# EAGLE schematic arm_board (EAGLE 8.1.0)

## Sheet 1 of 4: I/O
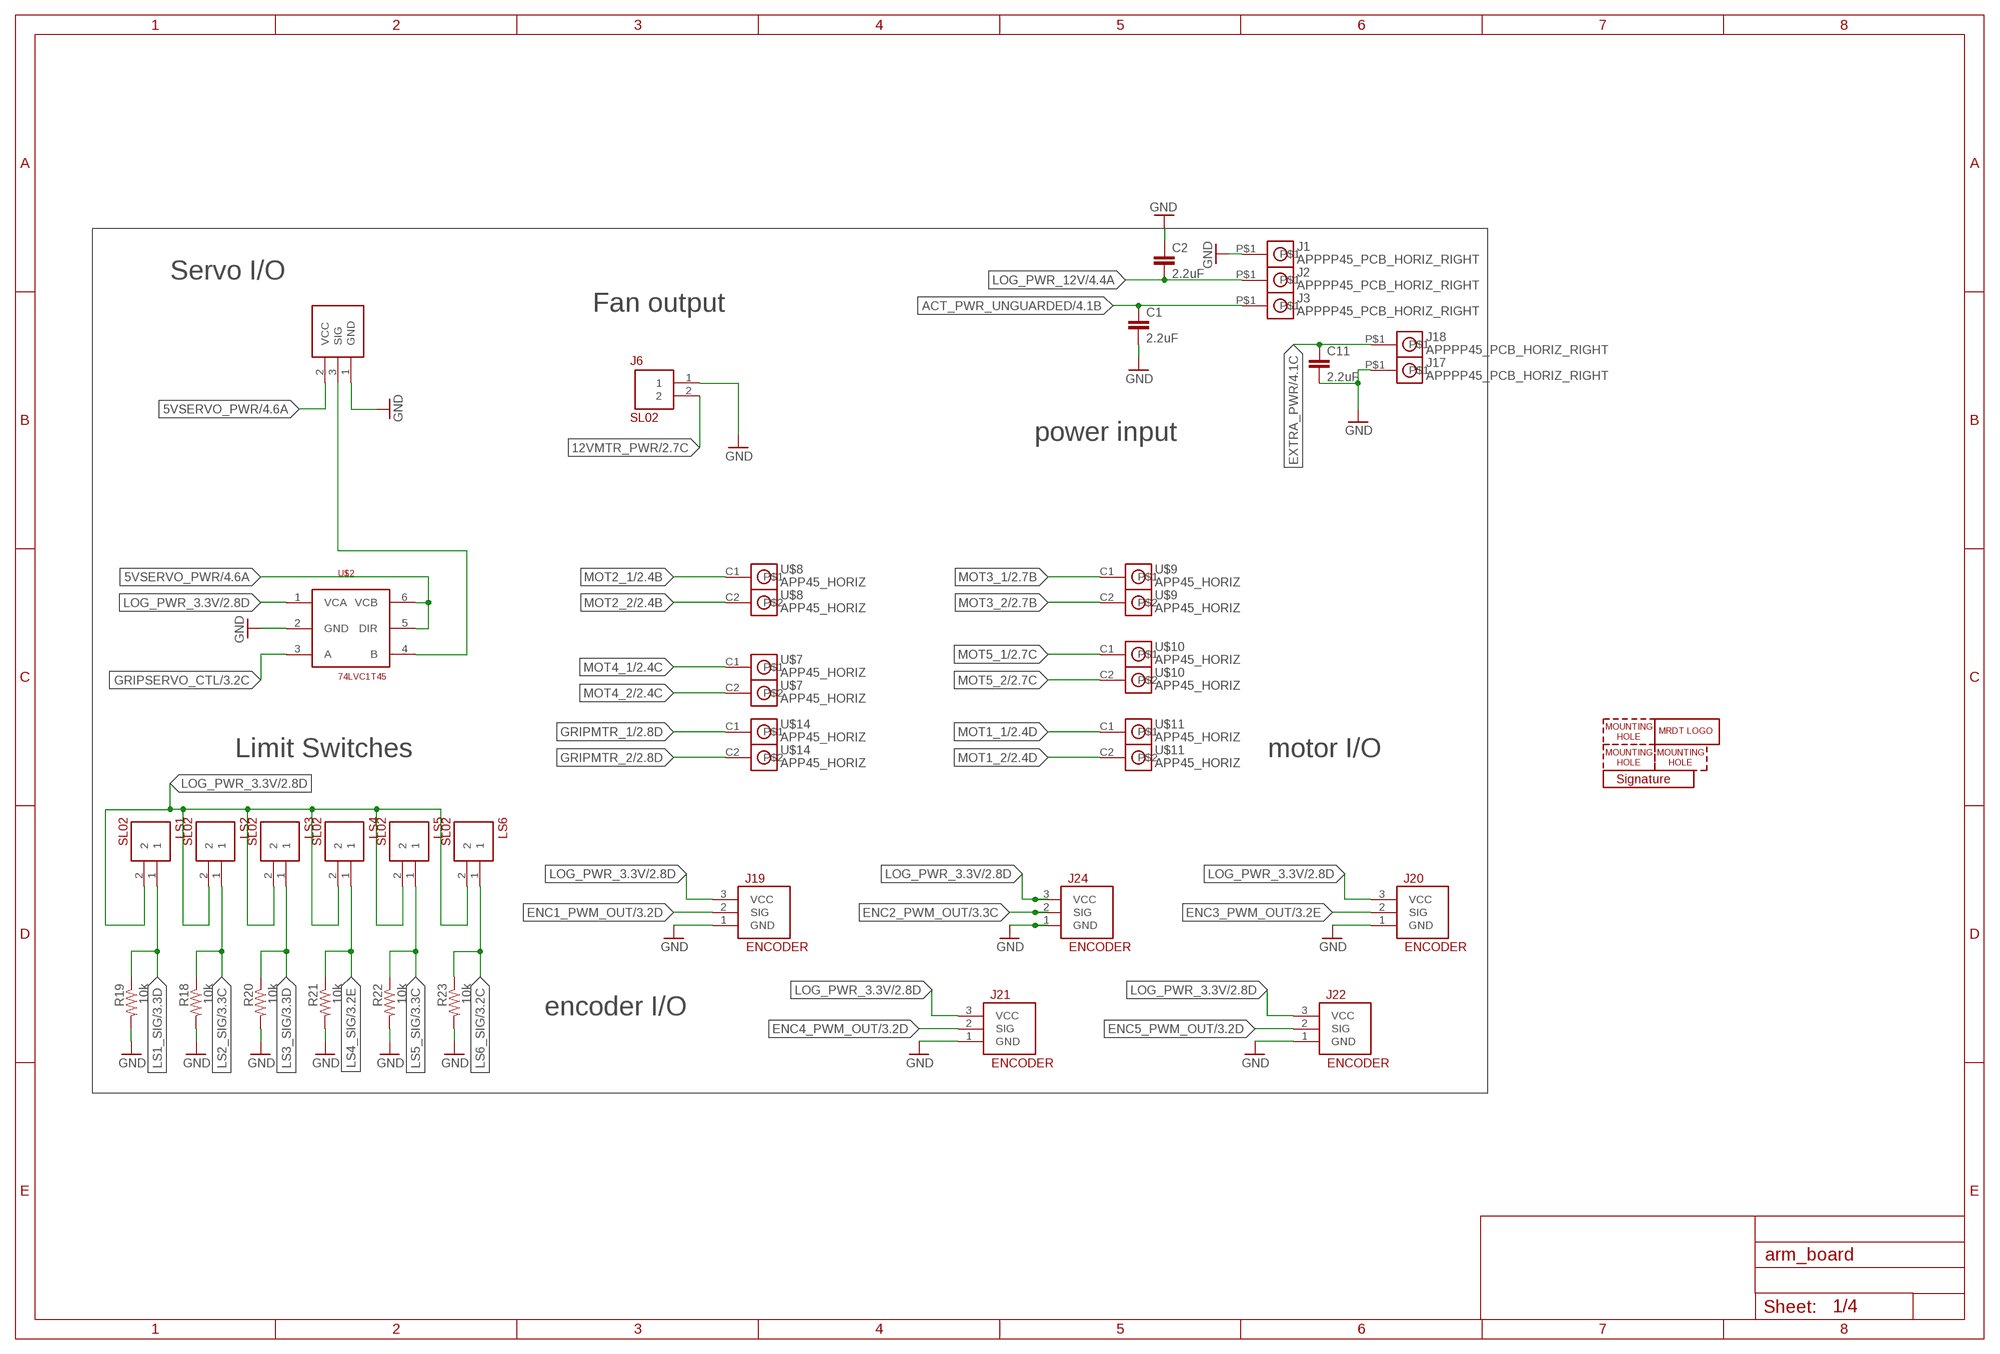
[diagram p0: schematic, sheet 1]

### Parts
C1  2.2uF  2.2UF-CERCAP-10009  [1206]
C2  2.2uF  2.2UF-CERCAP-10009  [1206]
C11  2.2uF  2.2UF-CERCAP-10009  [1206]
H1  MOUNTING_HOLE#4  [#4_SCREW]
H2  MOUNTING_HOLE#4  [#4_SCREW]
H4  MOUNTING_HOLE#4  [#4_SCREW]
J1  APPPP45_PCB_HORIZ_RIGHT  [APP45_PCB_HORIZ_RIGHT]
J2  APPPP45_PCB_HORIZ_RIGHT  [APP45_PCB_HORIZ_RIGHT]
J3  APPPP45_PCB_HORIZ_RIGHT  [APP45_PCB_HORIZ_RIGHT]
J5  SERVOMOLEX_SL_VERT_TH  [MOLEX-70543-0002]
J6  SL02  [MOLEX-70543-0001]
J17  APPPP45_PCB_HORIZ_RIGHT  [APP45_PCB_HORIZ_RIGHT]
J18  APPPP45_PCB_HORIZ_RIGHT  [APP45_PCB_HORIZ_RIGHT]
J19  ENCODER  [MOLEX-70543-0002]
J20  ENCODER  [MOLEX-70543-0002]
J21  ENCODER  [MOLEX-70543-0002]
J22  ENCODER  [MOLEX-70543-0002]
J24  ENCODER  [MOLEX-70543-0002]
LOGO1  MRDT_LOGO  [MRDT_LOGO]
LS1  SL02  [MOLEX-70543-0001]
LS2  SL02  [MOLEX-70543-0001]
LS3  SL02  [MOLEX-70543-0001]
LS4  SL02  [MOLEX-70543-0001]
LS5  SL02  [MOLEX-70543-0001]
LS6  SL02  [MOLEX-70543-0001]
R18  10k  RESISTOR0603-RES  [0603-RES]
R19  10k  RESISTOR0603-RES  [0603-RES]
R20  10k  RESISTOR0603-RES  [0603-RES]
R21  10k  RESISTOR0603-RES  [0603-RES]
R22  10k  RESISTOR0603-RES  [0603-RES]
R23  10k  RESISTOR0603-RES  [0603-RES]
U$2  74LVC1T45  [TSOP-6]
U$7  APP45_HORIZ  [APP45_HORIZ_CONFIG]
U$8  APP45_HORIZ  [APP45_HORIZ_CONFIG]
U$9  APP45_HORIZ  [APP45_HORIZ_CONFIG]
U$10  APP45_HORIZ  [APP45_HORIZ_CONFIG]
U$11  APP45_HORIZ  [APP45_HORIZ_CONFIG]
U$14  APP45_HORIZ  [APP45_HORIZ_CONFIG]
U$17  SIG  [SIG]

### Nets
5VSERVO_PWR: J5.2(VCC) U$2.5(DIR) U$2.6(VCB) ; also sheet 4
12VMTR_PWR: J6.2 ; also sheet 2,4
ACT_PWR_UNGUARDED: C1.1 J3.P$1 ; also sheet 4
ENC1_PWM_OUT: J19.2(SIG) ; also sheet 3
ENC2_PWM_OUT: J24.2(SIG) ; also sheet 3
ENC3_PWM_OUT: J20.2(SIG) ; also sheet 3
ENC4_PWM_OUT: J21.2(SIG) ; also sheet 3
ENC5_PWM_OUT: J22.2(SIG) ; also sheet 3
EXTRA_PWR: C11.1 J18.P$1 ; also sheet 4
GND: C1.2 C2.1 C11.2 J1.P$1 J5.1(GND) J6.1 J17.P$1 J19.1(GND) J20.1(GND) J21.1(GND) J22.1(GND) J24.1(GND) R18.2 R19.2 R20.2 R21.2 R22.2 R23.2 U$2.2(GND) ; also sheet 2,3,4
GRIPMTR_1: U$14.C1 ; also sheet 2
GRIPMTR_2: U$14.C2 ; also sheet 2
GRIPSERVO_CTL: U$2.3(A) ; also sheet 3
LOG_PWR_3.3V: J19.3(VCC) J20.3(VCC) J21.3(VCC) J22.3(VCC) J24.3(VCC) LS1.2 LS2.2 LS3.2 LS4.2 LS5.2 LS6.2 U$2.1(VCA) ; also sheet 2,3,4
LOG_PWR_12V: C2.2 J2.P$1 ; also sheet 4
LS1_SIG: LS1.1 R19.1 ; also sheet 3
LS2_SIG: LS2.1 R18.1 ; also sheet 3
LS3_SIG: LS3.1 R20.1 ; also sheet 3
LS4_SIG: LS4.1 R21.1 ; also sheet 3
LS5_SIG: LS5.1 R22.1 ; also sheet 3
LS6_SIG: LS6.1 R23.1 ; also sheet 3
MOT1_1: U$11.C1 ; also sheet 2
MOT1_2: U$11.C2 ; also sheet 2
MOT2_1: U$8.C1 ; also sheet 2
MOT2_2: U$8.C2 ; also sheet 2
MOT3_1: U$9.C1 ; also sheet 2
MOT3_2: U$9.C2 ; also sheet 2
MOT4_1: U$7.C1 ; also sheet 2
MOT4_2: U$7.C2 ; also sheet 2
MOT5_1: U$10.C1 ; also sheet 2
MOT5_2: U$10.C2 ; also sheet 2
N$2: J5.3(SIG) U$2.4(B)

### Notes on the sheet
- Servo I/O
- Fan output
- power input
- Limit Switches | motor I/O
- encoder I/O

## Sheet 2 of 4: Hbridge
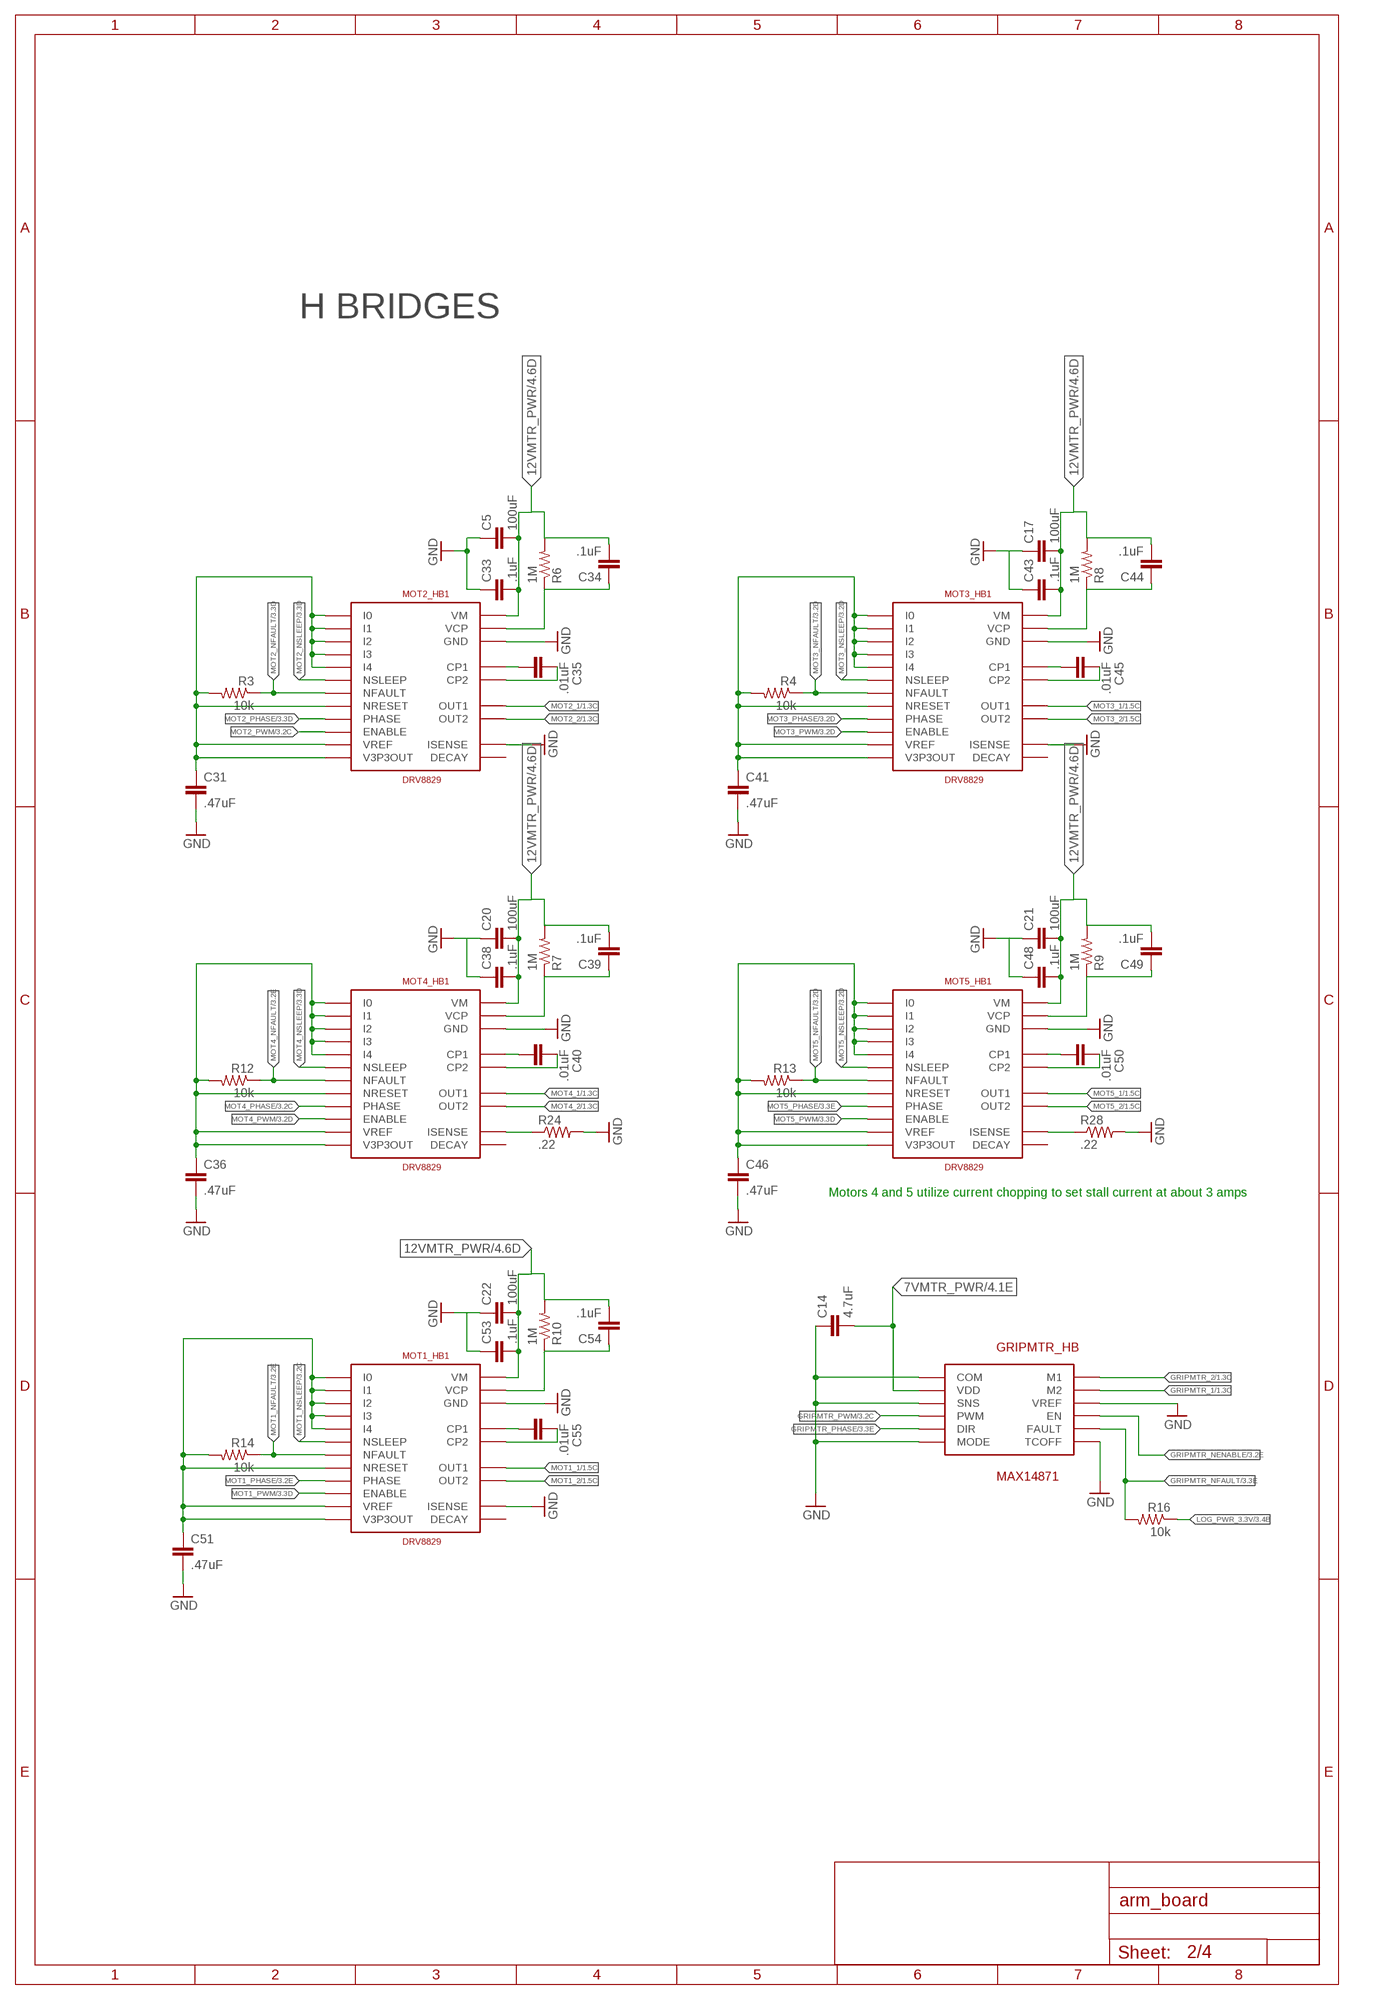
[diagram p1: schematic, sheet 2]

### Parts
C5  100uF  CAP1210  [1210]
C14  4.7uF  1.0UF50V10%(1206)  [1206]
C17  100uF  CAP1210  [1210]
C20  100uF  CAP1210  [1210]
C21  100uF  CAP1210  [1210]
C22  100uF  CAP1210  [1210]
C31  .47uF  0.1UF-25V(+80/-20%)(0603)  [0603-CAP]
C33  .1uF  0.1UF-25V(+80/-20%)(0603)  [0603-CAP]
C34  .1uF  0.1UF-25V(+80/-20%)(0603)  [0603-CAP]
C35  .01uF  0.1UF-25V(+80/-20%)(0603)  [0603-CAP]
C36  .47uF  0.1UF-25V(+80/-20%)(0603)  [0603-CAP]
C38  .1uF  0.1UF-25V(+80/-20%)(0603)  [0603-CAP]
C39  .1uF  0.1UF-25V(+80/-20%)(0603)  [0603-CAP]
C40  .01uF  0.1UF-25V(+80/-20%)(0603)  [0603-CAP]
C41  .47uF  0.1UF-25V(+80/-20%)(0603)  [0603-CAP]
C43  .1uF  0.1UF-25V(+80/-20%)(0603)  [0603-CAP]
C44  .1uF  0.1UF-25V(+80/-20%)(0603)  [0603-CAP]
C45  .01uF  0.1UF-25V(+80/-20%)(0603)  [0603-CAP]
C46  .47uF  0.1UF-25V(+80/-20%)(0603)  [0603-CAP]
C48  .1uF  0.1UF-25V(+80/-20%)(0603)  [0603-CAP]
C49  .1uF  0.1UF-25V(+80/-20%)(0603)  [0603-CAP]
C50  .01uF  0.1UF-25V(+80/-20%)(0603)  [0603-CAP]
C51  .47uF  0.1UF-25V(+80/-20%)(0603)  [0603-CAP]
C53  .1uF  0.1UF-25V(+80/-20%)(0603)  [0603-CAP]
C54  .1uF  0.1UF-25V(+80/-20%)(0603)  [0603-CAP]
C55  .01uF  0.1UF-25V(+80/-20%)(0603)  [0603-CAP]
GRIPMTR_HB  MAX14871  [TSSOP-16]
MOT1_HB1  DRV8829  [TSSOP28-GROUNDPAD]
MOT2_HB1  DRV8829  [TSSOP28-GROUNDPAD]
MOT3_HB1  DRV8829  [TSSOP28-GROUNDPAD]
MOT4_HB1  DRV8829  [TSSOP28-GROUNDPAD]
MOT5_HB1  DRV8829  [TSSOP28-GROUNDPAD]
R3  10k  RESISTOR0603-RES  [0603-RES]
R4  10k  RESISTOR0603-RES  [0603-RES]
R6  1M  RESISTOR0603-RES  [0603-RES]
R7  1M  RESISTOR0603-RES  [0603-RES]
R8  1M  RESISTOR0603-RES  [0603-RES]
R9  1M  RESISTOR0603-RES  [0603-RES]
R10  1M  RESISTOR0603-RES  [0603-RES]
R12  10k  RESISTOR0603-RES  [0603-RES]
R13  10k  RESISTOR0603-RES  [0603-RES]
R14  10k  RESISTOR0603-RES  [0603-RES]
R16  10k  RESISTOR0603-RES  [0603-RES]
R24  .22  RESISTOR2512  [R2512]
R28  .22  RESISTOR2512  [R2512]

### Nets
7VMTR_PWR: C14.2 GRIPMTR_HB.4(VDD) GRIPMTR_HB.13(VDD) ; also sheet 4
12VMTR_PWR: C5.2 C17.2 C20.2 C21.2 C22.2 C33.2 C34.2 C38.2 C39.2 C43.2 C44.2 C48.2 C49.2 C53.2 C54.2 MOT1_HB1.4(VM) MOT1_HB1.11(VM) MOT2_HB1.4(VM) MOT2_HB1.11(VM) MOT3_HB1.4(VM) MOT3_HB1.11(VM) MOT4_HB1.4(VM) MOT4_HB1.11(VM) MOT5_HB1.4(VM) MOT5_HB1.11(VM) R6.2 R7.2 R8.2 R9.2 R10.2 ; also sheet 1,4
GND: C5.1 C14.1 C17.1 C20.1 C21.1 C22.1 C31.2 C33.1 C36.2 C38.1 C41.2 C43.1 C46.2 C48.1 C51.2 C53.1 GRIPMTR_HB.1(COM) GRIPMTR_HB.5(SNS) GRIPMTR_HB.8(MODE) GRIPMTR_HB.9(TCOFF) GRIPMTR_HB.12(VREF) GRIPMTR_HB.16(COM) MOT1_HB1.6(ISENSE) MOT1_HB1.9(ISENSE) MOT1_HB1.14(GND) MOT1_HB1.28(GND) MOT1_HB1.29(GND) MOT2_HB1.6(ISENSE) MOT2_HB1.9(ISENSE) MOT2_HB1.14(GND) MOT2_HB1.28(GND) MOT2_HB1.29(GND) MOT3_HB1.6(ISENSE) MOT3_HB1.9(ISENSE) MOT3_HB1.14(GND) MOT3_HB1.28(GND) MOT3_HB1.29(GND) MOT4_HB1.14(GND) MOT4_HB1.28(GND) MOT4_HB1.29(GND) MOT5_HB1.14(GND) MOT5_HB1.28(GND) MOT5_HB1.29(GND) R24.2 R28.2 ; also sheet 1,3,4
GRIPMTR_1: GRIPMTR_HB.14(M2) GRIPMTR_HB.15(M2) ; also sheet 1
GRIPMTR_2: GRIPMTR_HB.2(M1) GRIPMTR_HB.3(M1) ; also sheet 1
GRIPMTR_NENABLE: GRIPMTR_HB.11(EN) ; also sheet 3
GRIPMTR_NFAULT: GRIPMTR_HB.10(FAULT) R16.2 ; also sheet 3
GRIPMTR_PHASE: GRIPMTR_HB.7(DIR) ; also sheet 3
GRIPMTR_PWM: GRIPMTR_HB.6(PWM) ; also sheet 3
HB_3.3_OUTPUT5: C31.1 MOT2_HB1.12(VREF) MOT2_HB1.13(VREF) MOT2_HB1.15(V3P3OUT) MOT2_HB1.16(NRESET) MOT2_HB1.23(I0) MOT2_HB1.24(I1) MOT2_HB1.25(I2) MOT2_HB1.26(I3) MOT2_HB1.27(I4) R3.2
HB_3.3_OUTPUT6: C36.1 MOT4_HB1.12(VREF) MOT4_HB1.13(VREF) MOT4_HB1.15(V3P3OUT) MOT4_HB1.16(NRESET) MOT4_HB1.23(I0) MOT4_HB1.24(I1) MOT4_HB1.25(I2) MOT4_HB1.26(I3) MOT4_HB1.27(I4) R12.2
HB_3.3_OUTPUT7: C41.1 MOT3_HB1.12(VREF) MOT3_HB1.13(VREF) MOT3_HB1.15(V3P3OUT) MOT3_HB1.16(NRESET) MOT3_HB1.23(I0) MOT3_HB1.24(I1) MOT3_HB1.25(I2) MOT3_HB1.26(I3) MOT3_HB1.27(I4) R4.2
HB_3.3_OUTPUT8: C46.1 MOT5_HB1.12(VREF) MOT5_HB1.13(VREF) MOT5_HB1.15(V3P3OUT) MOT5_HB1.16(NRESET) MOT5_HB1.23(I0) MOT5_HB1.24(I1) MOT5_HB1.25(I2) MOT5_HB1.26(I3) MOT5_HB1.27(I4) R13.2
HB_3.3_OUTPUT9: C51.1 MOT1_HB1.12(VREF) MOT1_HB1.13(VREF) MOT1_HB1.15(V3P3OUT) MOT1_HB1.16(NRESET) MOT1_HB1.23(I0) MOT1_HB1.24(I1) MOT1_HB1.25(I2) MOT1_HB1.26(I3) MOT1_HB1.27(I4) R14.2
LOG_PWR_3.3V: R16.1 ; also sheet 1,3,4
MOT1_1: MOT1_HB1.5(OUT1) MOT1_HB1.10(OUT1) ; also sheet 1
MOT1_2: MOT1_HB1.7(OUT2) MOT1_HB1.8(OUT2) ; also sheet 1
MOT1_NFAULT: MOT1_HB1.18(NFAULT) R14.1 ; also sheet 3
MOT1_NSLEEP: MOT1_HB1.17(NSLEEP) ; also sheet 3
MOT1_PHASE: MOT1_HB1.20(PHASE) ; also sheet 3
MOT1_PWM: MOT1_HB1.21(ENABLE) ; also sheet 3
MOT2_1: MOT2_HB1.5(OUT1) MOT2_HB1.10(OUT1) ; also sheet 1
MOT2_2: MOT2_HB1.7(OUT2) MOT2_HB1.8(OUT2) ; also sheet 1
MOT2_NFAULT: MOT2_HB1.18(NFAULT) R3.1 ; also sheet 3
MOT2_NSLEEP: MOT2_HB1.17(NSLEEP) ; also sheet 3
MOT2_PHASE: MOT2_HB1.20(PHASE) ; also sheet 3
MOT2_PWM: MOT2_HB1.21(ENABLE) ; also sheet 3
MOT3_1: MOT3_HB1.5(OUT1) MOT3_HB1.10(OUT1) ; also sheet 1
MOT3_2: MOT3_HB1.7(OUT2) MOT3_HB1.8(OUT2) ; also sheet 1
MOT3_NFAULT: MOT3_HB1.18(NFAULT) R4.1 ; also sheet 3
MOT3_NSLEEP: MOT3_HB1.17(NSLEEP) ; also sheet 3
MOT3_PHASE: MOT3_HB1.20(PHASE) ; also sheet 3
MOT3_PWM: MOT3_HB1.21(ENABLE) ; also sheet 3
MOT4_1: MOT4_HB1.5(OUT1) MOT4_HB1.10(OUT1) ; also sheet 1
MOT4_2: MOT4_HB1.7(OUT2) MOT4_HB1.8(OUT2) ; also sheet 1
MOT4_NFAULT: MOT4_HB1.18(NFAULT) R12.1 ; also sheet 3
MOT4_NSLEEP: MOT4_HB1.17(NSLEEP) ; also sheet 3
MOT4_PHASE: MOT4_HB1.20(PHASE) ; also sheet 3
MOT4_PWM: MOT4_HB1.21(ENABLE) ; also sheet 3
MOT5_1: MOT5_HB1.5(OUT1) MOT5_HB1.10(OUT1) ; also sheet 1
MOT5_2: MOT5_HB1.7(OUT2) MOT5_HB1.8(OUT2) ; also sheet 1
MOT5_NFAULT: MOT5_HB1.18(NFAULT) R13.1 ; also sheet 3
MOT5_NSLEEP: MOT5_HB1.17(NSLEEP) ; also sheet 3
MOT5_PHASE: MOT5_HB1.20(PHASE) ; also sheet 3
MOT5_PWM: MOT5_HB1.21(ENABLE) ; also sheet 3
N$5: MOT4_HB1.6(ISENSE) MOT4_HB1.9(ISENSE) R24.1
N$6: MOT5_HB1.6(ISENSE) MOT5_HB1.9(ISENSE) R28.1
N$17: C34.1 MOT2_HB1.3(VCP) R6.1
N$18: C35.2 MOT2_HB1.1(CP1)
N$19: C35.1 MOT2_HB1.2(CP2)
N$20: C39.1 MOT4_HB1.3(VCP) R7.1
N$21: C40.2 MOT4_HB1.1(CP1)
N$22: C40.1 MOT4_HB1.2(CP2)
N$23: C44.1 MOT3_HB1.3(VCP) R8.1
N$24: C45.2 MOT3_HB1.1(CP1)
N$25: C45.1 MOT3_HB1.2(CP2)
N$26: C49.1 MOT5_HB1.3(VCP) R9.1
N$27: C50.2 MOT5_HB1.1(CP1)
N$28: C50.1 MOT5_HB1.2(CP2)
N$29: C54.1 MOT1_HB1.3(VCP) R10.1
N$30: C55.2 MOT1_HB1.1(CP1)
N$31: C55.1 MOT1_HB1.2(CP2)
Unconnected: MOT1_HB1.19(DECAY) MOT2_HB1.19(DECAY) MOT3_HB1.19(DECAY) MOT4_HB1.19(DECAY) MOT5_HB1.19(DECAY)

### Notes on the sheet
- H BRIDGES
- Motors 4 and 5 utilize current chopping to set stall current at about 3 amps

## Sheet 3 of 4: Computers
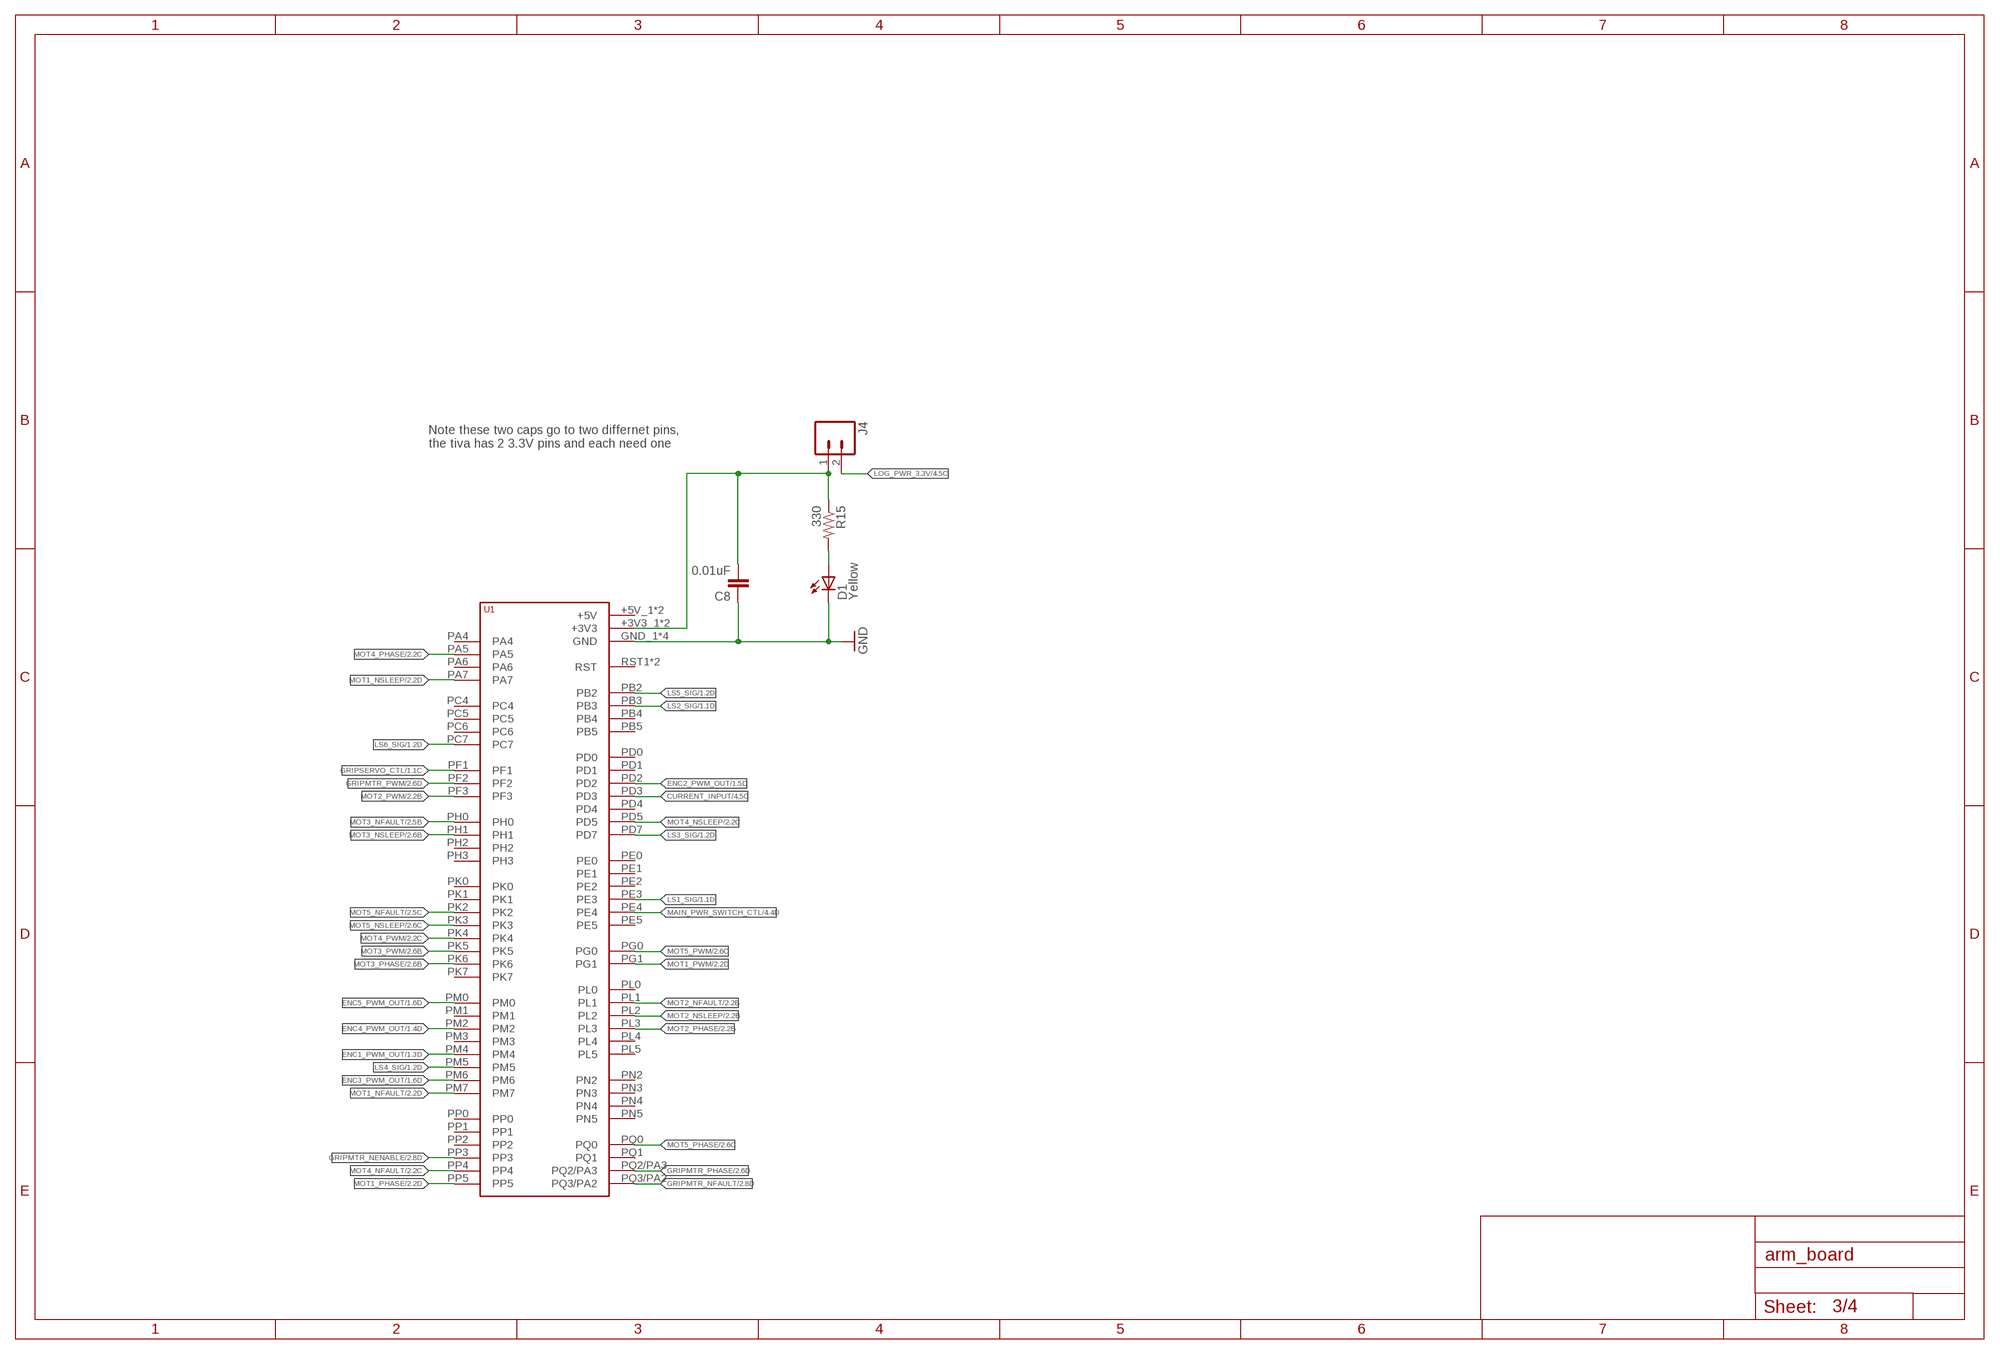
[diagram p2: schematic, sheet 3]

### Parts
C8  0.01uF  0.1UF-25V-5%(0603)  [0603-CAP]
D1  Yellow  LED-YELLOWLILYPAD  [LED-1206]
J4  M02PTH  [1X02]
R15  330  8.2K-5%  [0603-RES@1]
U1  TIVA-1294  [TIVA-C-CONNECTED]

### Nets
CURRENT_INPUT: U1.PD3 ; also sheet 4
ENC1_PWM_OUT: U1.PM4 ; also sheet 1
ENC2_PWM_OUT: U1.PD2 ; also sheet 1
ENC3_PWM_OUT: U1.PM6 ; also sheet 1
ENC4_PWM_OUT: U1.PM2 ; also sheet 1
ENC5_PWM_OUT: U1.PM0 ; also sheet 1
GND: C8.1 D1.C U1.GND_1(GND) U1.GND_2(GND) U1.GND_3(GND) U1.GND_4(GND) ; also sheet 1,2,4
GRIPMTR_NENABLE: U1.PP3 ; also sheet 2
GRIPMTR_NFAULT: U1.PQ3/PA2 ; also sheet 2
GRIPMTR_PHASE: U1.PQ2/PA3 ; also sheet 2
GRIPMTR_PWM: U1.PF2 ; also sheet 2
GRIPSERVO_CTL: U1.PF1 ; also sheet 1
LOG_PWR_3.3V: J4.2 ; also sheet 1,2,4
LS1_SIG: U1.PE3 ; also sheet 1
LS2_SIG: U1.PB3 ; also sheet 1
LS3_SIG: U1.PD7 ; also sheet 1
LS4_SIG: U1.PM5 ; also sheet 1
LS5_SIG: U1.PB2 ; also sheet 1
LS6_SIG: U1.PC7 ; also sheet 1
MAIN_PWR_SWITCH_CTL: U1.PE4 ; also sheet 4
MOT1_NFAULT: U1.PM7 ; also sheet 2
MOT1_NSLEEP: U1.PA7 ; also sheet 2
MOT1_PHASE: U1.PP5 ; also sheet 2
MOT1_PWM: U1.PG1 ; also sheet 2
MOT2_NFAULT: U1.PL1 ; also sheet 2
MOT2_NSLEEP: U1.PL2 ; also sheet 2
MOT2_PHASE: U1.PL3 ; also sheet 2
MOT2_PWM: U1.PF3 ; also sheet 2
MOT3_NFAULT: U1.PH0 ; also sheet 2
MOT3_NSLEEP: U1.PH1 ; also sheet 2
MOT3_PHASE: U1.PK6 ; also sheet 2
MOT3_PWM: U1.PK5 ; also sheet 2
MOT4_NFAULT: U1.PP4 ; also sheet 2
MOT4_NSLEEP: U1.PD5 ; also sheet 2
MOT4_PHASE: U1.PA5 ; also sheet 2
MOT4_PWM: U1.PK4 ; also sheet 2
MOT5_NFAULT: U1.PK2 ; also sheet 2
MOT5_NSLEEP: U1.PK3 ; also sheet 2
MOT5_PHASE: U1.PQ0 ; also sheet 2
MOT5_PWM: U1.PG0 ; also sheet 2
N$16: D1.A R15.2
N$32: C8.2 J4.1 R15.1 U1.+3V3_1(+3V3) U1.+3V3_2(+3V3)
Unconnected: U1.+5V_1(+5V) U1.+5V_2(+5V) U1.PA4 U1.PA6 U1.PB4 U1.PB5 U1.PC4 U1.PC5 U1.PC6 U1.PD0 U1.PD1 U1.PD4 U1.PE0 U1.PE1 U1.PE2 U1.PE5 U1.PH2 U1.PH3 U1.PK0 U1.PK1 U1.PK7 U1.PL0 U1.PL4 U1.PL5 U1.PM1 U1.PM3 U1.PN2 U1.PN3 U1.PN4 U1.PN5 U1.PP0 U1.PP1 U1.PP2 U1.PQ1 U1.RST1(RST) U1.RST_2(RST)

### Notes on the sheet
- Note these two caps go to two differnet pins,
  the tiva has 2 3.3V pins and each need one

## Sheet 4 of 4: Power
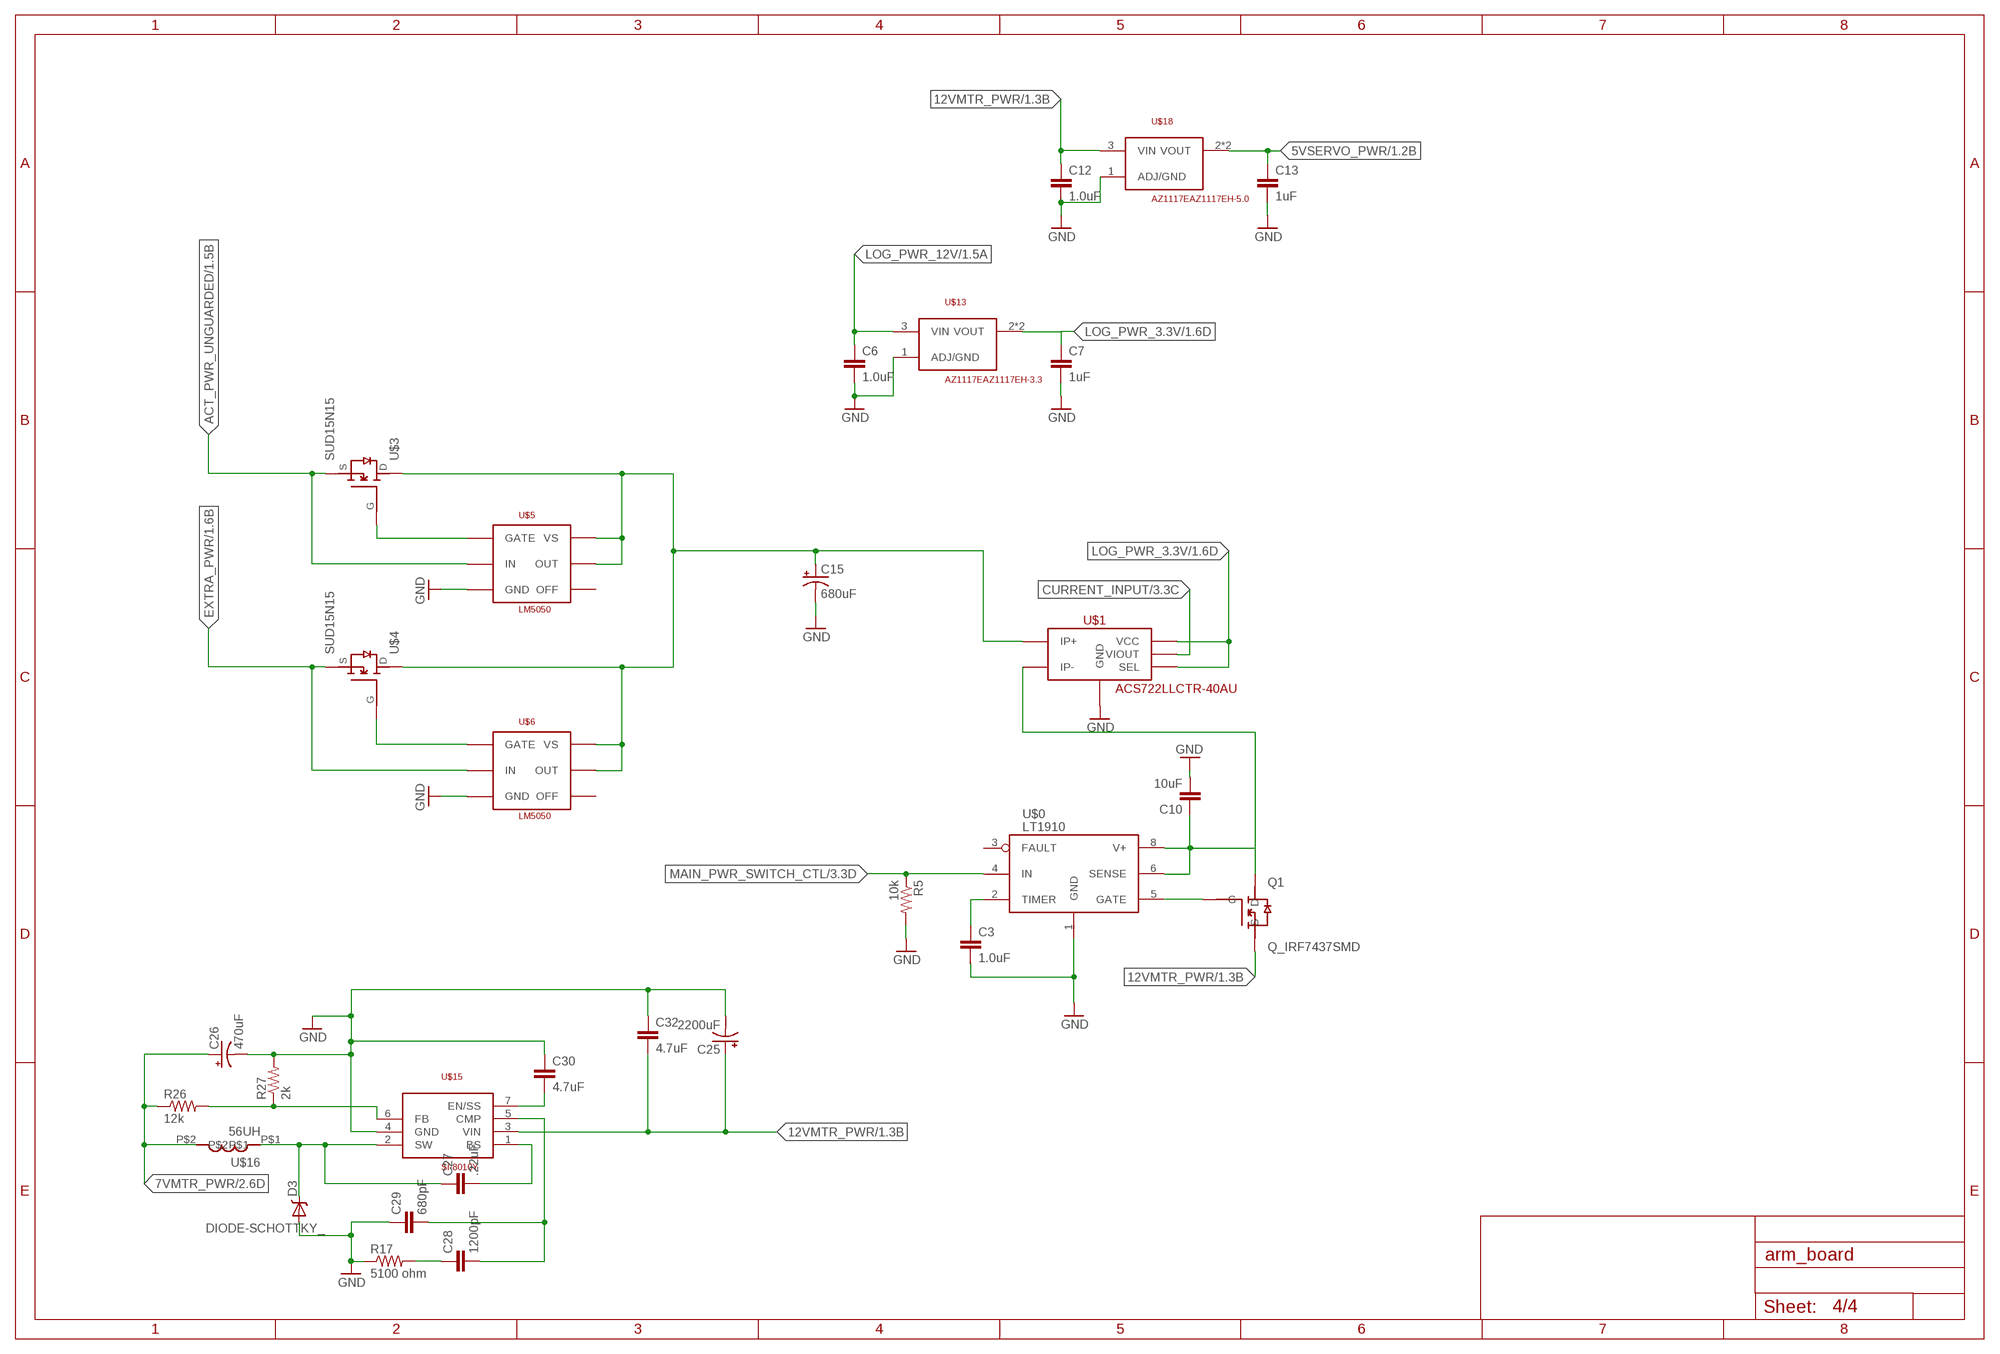
[diagram p3: schematic, sheet 4]

### Parts
C3  1.0uF  1.0UF-16V-10%(0603)  [0603-CAP]
C6  1.0uF  1.0UF-16V-10%(0603)  [0603-CAP]
C7  1uF  0.1UF-25V(+80/-20%)(0603)  [0603-CAP]
C10  10uF  1UF-25V-10%(0805)  [0805]
C12  1.0uF  1.0UF-16V-10%(0603)  [0603-CAP]
C13  1uF  0.1UF-25V(+80/-20%)(0603)  [0603-CAP]
C15  680uF  CAP_POLG  [PANASONIC_G]
C25  2200uF  C_108CKH050M  [C_16MM]
C26  470uF  100UF-ELECT  [PANASONIC_H13]
C27  .22uF  1.0UF50V10%(1206)  [1206]
C28  1200pF  1.0UF50V10%(1206)  [1206]
C29  680pF  1.0UF50V10%(1206)  [1206]
C30  4.7uF  1.0UF50V10%(1206)  [1206]
C32  4.7uF  1.0UF50V10%(1206)  [1206]
D3  DIODE-SCHOTTKY_  [SMA-DIODE]
Q1  Q_IRF7437SMD  [D2PACK]
R5  10k  RESISTOR0603-RES  [0603-RES]
R17  5100 ohm  RESISTOR0603-RES  [0603-RES]
R26  12k  RESISTOR0603-RES  [0603-RES]
R27  2k  RESISTOR0603-RES  [0603-RES]
U$0  LT1910  [SO8]
U$1  ACS722LLCTR-40AU  ACS722LL  [SOIC8]
U$3  SUD15N15  [TO252]
U$4  SUD15N15  [TO252]
U$5  LM5050  [TSOT23-6]
U$6  LM5050  [TSOT23-6]
U$13  AZ1117EAZ1117EH-3.3  [SOT223]
U$15  SI-8010Y  [TO-220-7]
U$16  56UH  INDUCTOR  [.5*.5_SMD]
U$18  AZ1117EAZ1117EH-5.0  [SOT223]

### Nets
5VSERVO_PWR: C13.1 U$18.2(VOUT) U$18.4(VOUT) ; also sheet 1
7VMTR_PWR: C26.+ R26.1 U$16.P$2 ; also sheet 2
12VMTR_PWR: C12.1 C25.+ C32.2 Q1.2(S) U$15.3(VIN) U$18.3(VIN) ; also sheet 1,2
$N3: C10.1 Q1.TAB(D) U$0.6(SENSE) U$0.8(V+) U$1.3(IP-) U$1.4(IP-)
ACT_PWR_UNGUARDED: U$3.2(S) U$5.4(IN) ; also sheet 1
CURRENT_INPUT: U$1.7(VIOUT) ; also sheet 3
DUAL_PWR: C15.+ U$1.1(IP+) U$1.2(IP+) U$3.3(D) U$4.3(D) U$5.1(VS) U$5.6(OUT) U$6.1(VS) U$6.6(OUT)
EXTRA_PWR: U$4.2(S) U$6.4(IN) ; also sheet 1
GND: C3.2 C6.2 C7.2 C10.2 C12.2 C13.2 C15.- C25.GND(-) C26.- C29.1 C30.1 C32.1 D3.A R5.2 R17.1 R27.2 U$0.1(GND) U$1.5(GND) U$5.2(GND) U$6.2(GND) U$13.1(ADJ/GND) U$15.4(GND) U$18.1(ADJ/GND) ; also sheet 1,2,3
LOG_PWR_3.3V: C7.1 U$1.6(SEL) U$1.8(VCC) U$13.2(VOUT) U$13.4(VOUT) ; also sheet 1,2,3
LOG_PWR_12V: C6.1 U$13.3(VIN) ; also sheet 1
MAIN_PWR_SWITCH_CTL: R5.1 U$0.4(IN) ; also sheet 3
N$1: C3.1 U$0.2(TIMER)
N$3: Q1.1(G) U$0.5(GATE)
N$8: U$3.1(G) U$5.5(GATE)
N$9: C30.2 U$15.7(EN/SS)
N$10: R26.2 R27.1 U$15.6(FB)
N$11: U$4.1(G) U$6.5(GATE)
N$13: C28.1 R17.2
N$14: C28.2 C29.2 U$15.5(CMP)
N$15: C27.2 U$15.1(BS)
N$33: C27.1 D3.C U$15.2(SW) U$16.P$1
Unconnected: U$0.3(FAULT) U$5.3(OFF) U$6.3(OFF)

## Library data of the parts
C1 C2 C11 = SparkFun-Capacitors:2.2UF-CER: 2.2uF Ceramic SMT CAP-07888- 10V, 20% (0603) CAP-10009- 50V, 10% (1206); PROD_ID: CAP-10009
C3 C6 C12 = SparkFun-Capacitors:1.0UF-16V-10%(0603): CAP-00868; PROD_ID: CAP-00868
C5 C17 C20-C22 = SparkFun-Capacitors:CAP: Capacitor Standard 0603 ceramic capacitor, and 0.1" leaded capacitor.
C7 C13 C31 C33-C36 C38-C41 C43-C46 C48-C51 C53-C55 = SparkFun-Capacitors:0.1UF-25V(+80/-20%)(0603): Ceramic Standard decoupling cap CAP-00810; PROD_ID: CAP-00810; VALUE: 0.1uF
C8 = SparkFun-Capacitors:0.1UF-25V-5%(0603): CAP-08604; PROD_ID: CAP-08604; VALUE: 0.1uF
C10 = SparkFun-Capacitors:1UF-25V-10%(0805): CAP-08064; PROD_ID: CAP-08064; VALUE: 1uF
C14 C27-C30 C32 = MRDT-EAGLE-Training:1.0UF50V10%(1206): CAP-09822; PROD_ID: CAP-09822; VALUE: 1.0uF
C15 = SparkFun-Capacitors:CAP_POL: Capacitor Polarized These are standard SMD and PTH capacitors. Normally 10uF, 47uF, and 100uF in electrolytic and tantalum varieties. Always verify the external diameter of the through hole cap, it varies with capacity, voltage, and manufacturer. The EIA devices should be standard.
C25 = MRDT-2014-All:C_108CKH050M: CAP ALUM 50V 0.1mF 1.1A ripple
C26 = SparkFun-Capacitors:100UF-ELECT: 100uF electrolytic SMT CAP-08362- 63V 20%; PROD_ID: CAP-08362; VALUE: 100uF
D1 = SparkFun-LED:LED-YELLOW: Yellow SMD LEDs LilyPad 1206- DIO-09909 0603- DIO-09003; PROD_ID: DIO-09909
D3 = SparkFun-DiscreteSemi:DIODE-SCHOTTKY: Commonly MBRA140.
GRIPMTR_HB = tssopep:MAX14871: H bridge IC http://www.digikey.com/product-detail/en/maxim-integrated/MAX14871EUE-T/MAX14871EUE-CT-ND/5129512
H1 H2 H4 = MRDT-Hardware:MOUNTING_HOLE: Mounting hole for M6 bolt. Standard use mounting hole for: Tiva C Connected - M6 Anderson Powerpole Mounting Wing - M8 Most frame-mounted PCB's - M8
J1-J3 J17 J18 = MRDT-Connectors:APP: http://www.powerwerx.com/anderson-powerpoles/
J4 = SparkFun-Connectors:M02: Standard 2-pin 0.1" header. Use with - straight break away headers ( PRT-00116) - right angle break away headers (PRT-00553) - swiss pins (PRT-00743) - machine pins (PRT-00117) - female headers (PRT-00115) Molex polarized connector foot print use with: PRT-08233 with associated crimp pins and housings. 2.54_SCREWTERM for use with PRT-10571. 3.5mm Screw Terminal footprints for PRT-08084 5mm Screw Terminal footprints for use with PRT-08432
J5 = MRDT-Connectors:SERVO
J6 LS1-LS6 = MRDT-Connectors:SL02
J19-J22 J24 = MRDT-Connectors:ENCODER
LOGO1 = MRDT-Hardware:MRDT_LOGO
MOT1_HB1 MOT2_HB1 MOT3_HB1 MOT4_HB1 MOT5_HB1 = MRDT-ICs:DRV8829: 5A 45V H bridge, OC protection
Q1 = MRDT-2015-PowerBoard:Q_IRF*7437: 40V 195A N-CH MOSFET switch with heatsink
R3-R10 R12-R14 R16-R23 R26 R27 = SparkFun-Passives:RESISTOR: Resistor Basic schematic elements and footprints for 0603, 1206, and PTH resistors.
R15 = SparkFun-Resistors:8.2K-5%: 8.2k-ohm SMT 1/10W - 5% (0603) RES-10646; PROD_ID: RES-10646; VALUE: 8.2k
R24 R28 = SparkFun-Resistors:RESISTOR: Resistor Basic schematic elements and footprints for 0603, 1206, and PTH resistors.
U1 = MRDT-Microcontrollers:TIVA-1294: TIVA C CONNECTED LAUNCHPAD
U$0 = MRDT-2015-PowerBoard:LT1910
U$1 = MRDT-ICs:ACS722LL: Current sensor, outputs analog voltage
U$2 = MRDT-ICs:74LVC1T45: 1-5V level shifter
U$3 = mine:SUD15N15: NMOS 150V 15A
U$4 = MRDT-Semiconductors:SUD15N15: NMOS 150V 15A
U$5 U$6 = MRDT-ICs:LM5050: High-Side OR-ing FET Controller
U$7-U$11 U$14 = mine:APP45_HORIZ: Two stacked andersons, laying down horizontally
U$13 = MRDT-ICs:AZ1117E: Lin Volt Regulator, 13Vin max, 1 amp output. Adjustable or set voltage; VOUT: 3.3v
U$15 = MRDT-ICs:SI-8010Y: Step-down Switching Voltage regulator.; EFFICIENCY: 86%; IOUT: 8A; VINRANGE: 8-45; VOUTRANGE: 1-15
U$16 = MRDT-Passives:INDUCTOR
U$17 = drueLib:SIG
U$18 = MRDT-ICs:AZ1117E: Lin Volt Regulator, 13Vin max, 1 amp output. Adjustable or set voltage; VOUT: 5v